# EAGLE design photon_at7020_1_rf_test (EAGLE 7.1.0)
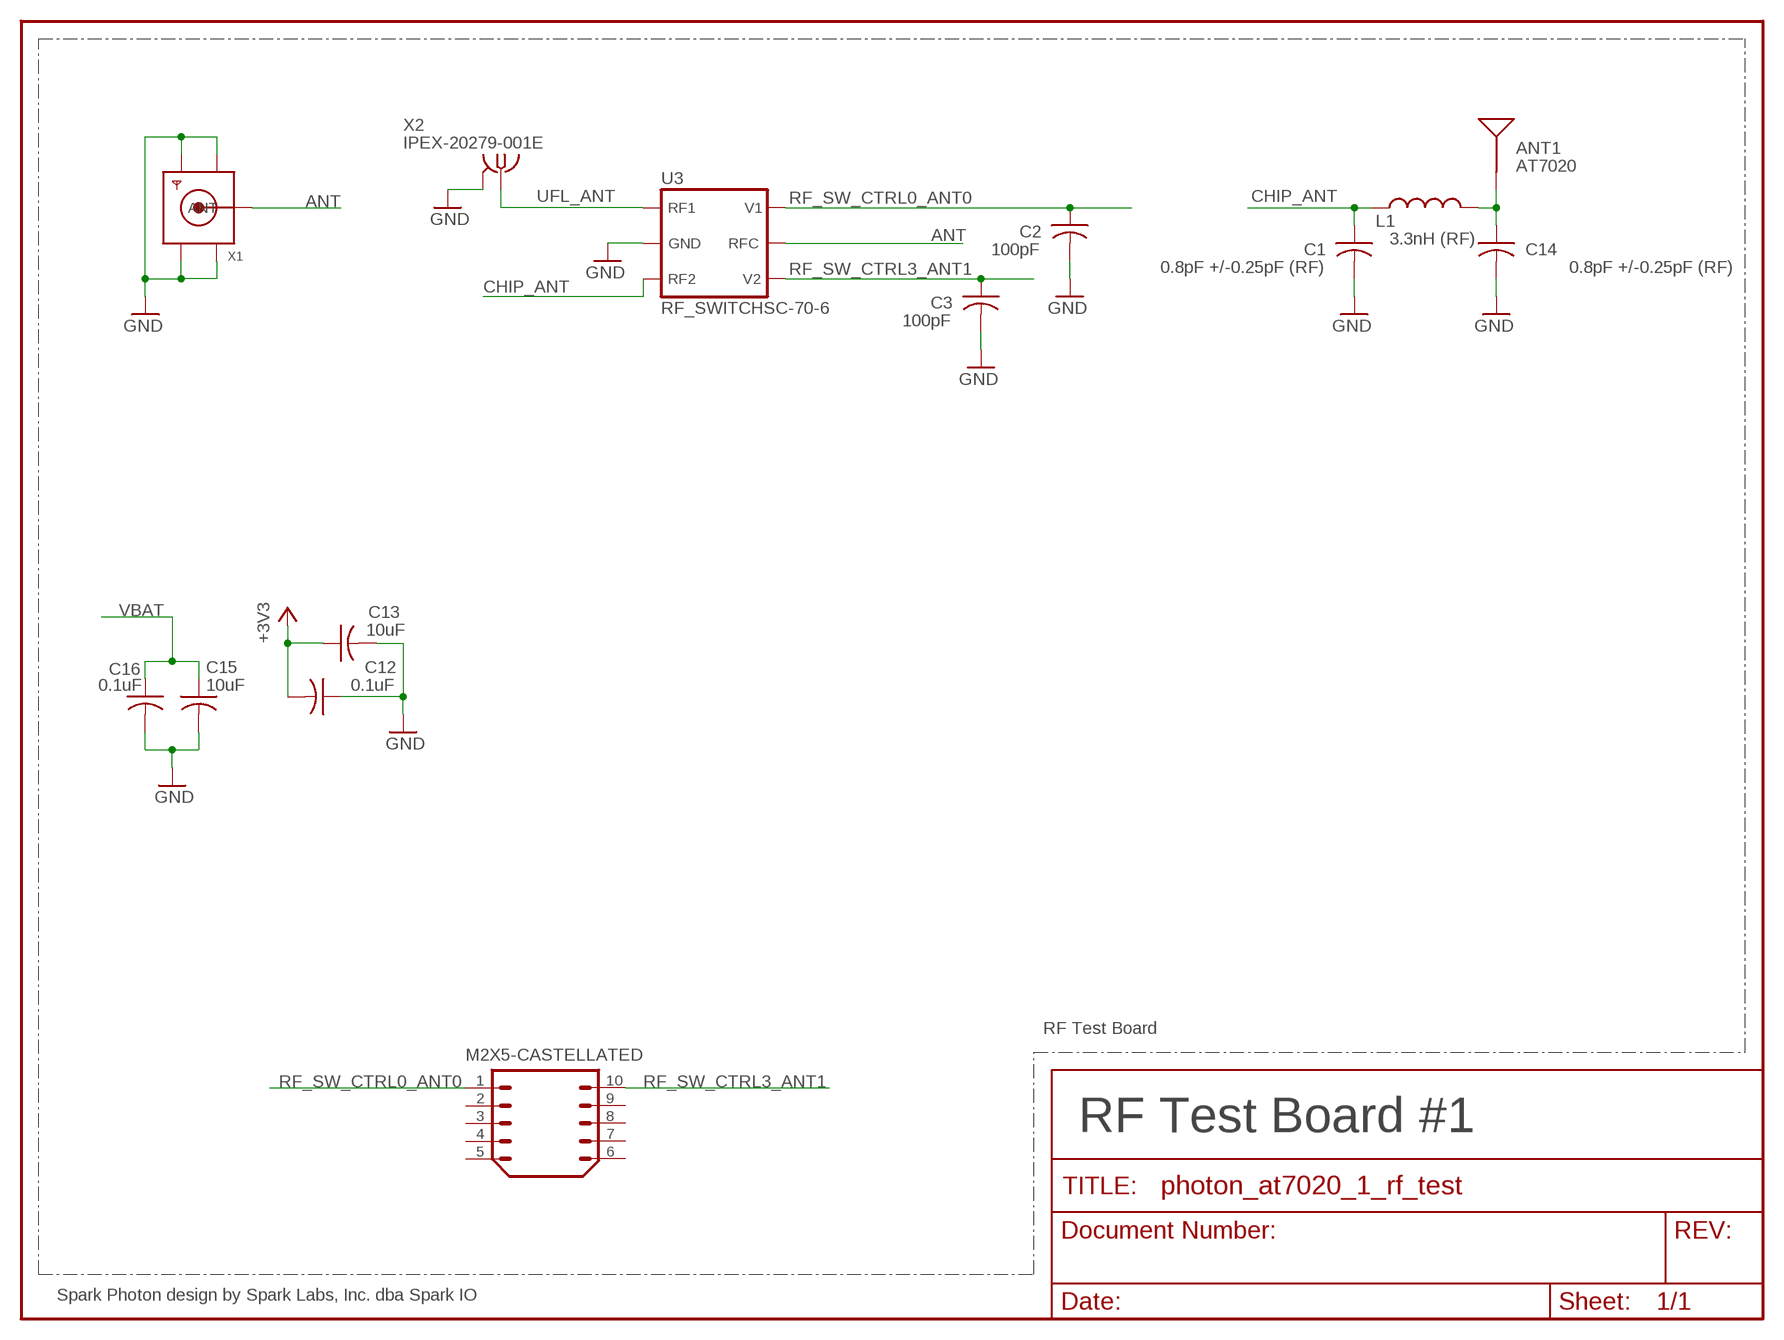
[diagram p0: schematic, sheet 1]

## Parts
ANT1  AT7020  [AT7020]
C1  0.8pF +/-0.25pF (RF)  C-US  [C0402_B]
C2  100pF  C-US  [C0402_B]
C3  100pF  C-US  [C0402_B]
C12  0.1uF  C-US  [C0402_B]
C13  10uF  C-US  [C0402_B]
C14  0.8pF +/-0.25pF (RF)  C-US  [C0402_B]
C15  10uF  C-US  [C0402_B]
C16  0.1uF  C-US  [C0402_B]
L1  3.3nH (RF)  INDUCTOR  [L0402_B]
M2X5-CASTELLATED  M2X5  [2X5-CASTELLATED]
U3  RF_SWITCHSC-70-6  [SC70-6]
X1  SMACONNECTOR_EDGE  [SMA_EDGELAUNCH]
X2  IPEX-20279-001E  [IPEX-20279-001E]

## Nets
+3V3: C12.2 C13.1
ANT [RF]: U3.5(RFC) X1.P(ANT)
CHIP_ANT [RF]: C1.1 L1.1 U3.3(RF2)
GND: C1.2 C2.2 C3.2 C12.1 C13.2 C14.2 C15.2 C16.2 U3.2(GND) X1.GND@1(GND4) X1.GND@2(GND3) X1.GND@3(GND2) X1.GND@4(GND1) X2.2@1(GND) X2.2@2(GND)
N$2 [RF]: ANT1.1(SIGNAL) C14.1 L1.2
RF_SW_CTRL0_ANT0: C2.1 M2X5-CASTELLATED.1 U3.6(V1)
RF_SW_CTRL3_ANT1: C3.1 M2X5-CASTELLATED.10 U3.4(V2)
UFL_ANT [RF]: U3.1(RF1) X2.1
VBAT: C15.1 C16.1
Unconnected: M2X5-CASTELLATED.2 M2X5-CASTELLATED.3 M2X5-CASTELLATED.4 M2X5-CASTELLATED.5 M2X5-CASTELLATED.6 M2X5-CASTELLATED.7 M2X5-CASTELLATED.8 M2X5-CASTELLATED.9

## Notes on the sheet
- RF Test Board
- RF Test Board #1
- Spark Photon design by Spark Labs, Inc. dba Spark IO

## Library data of the parts
ANT1 = Spark:AT7020
C1-C3 C12-C16 = Spark:C-US: Capacitor
L1 = Spark:INDUCTOR
M2X5-CASTELLATED = Spark:M2X5
U3 = Spark:RF_SWITCH: GaAs SPDT Switch DC - 3.0GHz+
X1 = adafruit:SMACONNECTOR: SMA Connector 90° DIP SMA Connector, 50 Ohm (4UConnector: 07259)
X2 = Spark:IPEX-20279-001E: Ultra Miniature Coaxial SMT RF Receptacle

## Net classes
2 RF: width 0.318 mm, clearance 0.191 mm

## Board
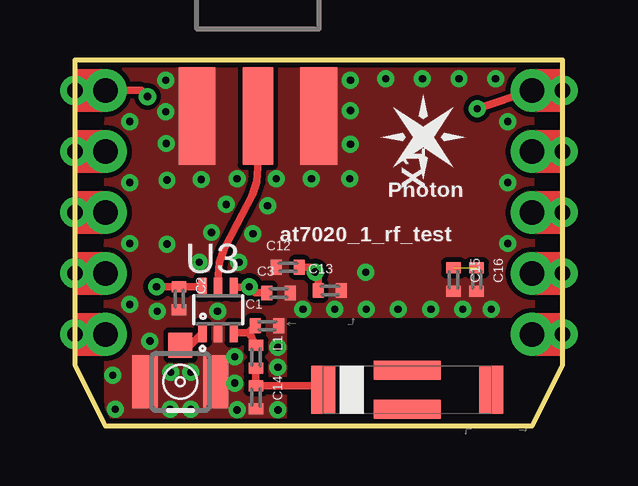
[diagram p1: board, top side]
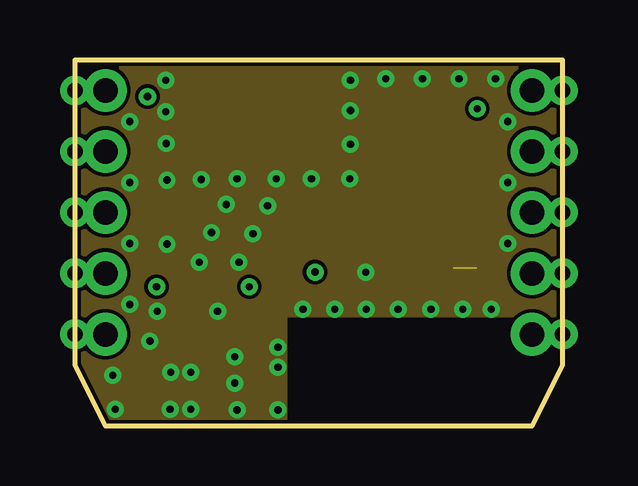
[diagram p2: board, inner layer $GND]
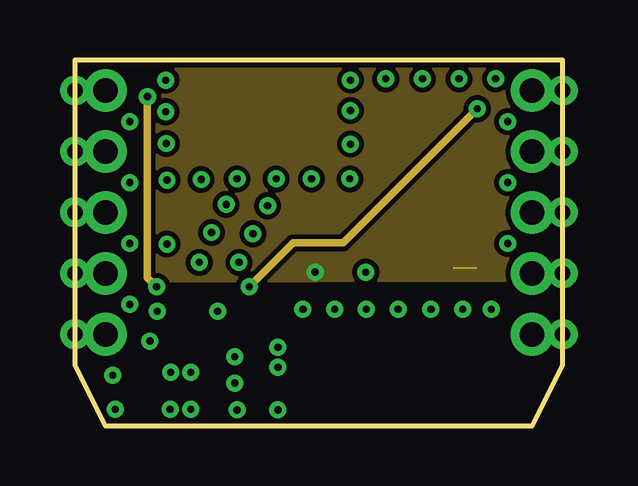
[diagram p3: board, inner layer $+3V3]
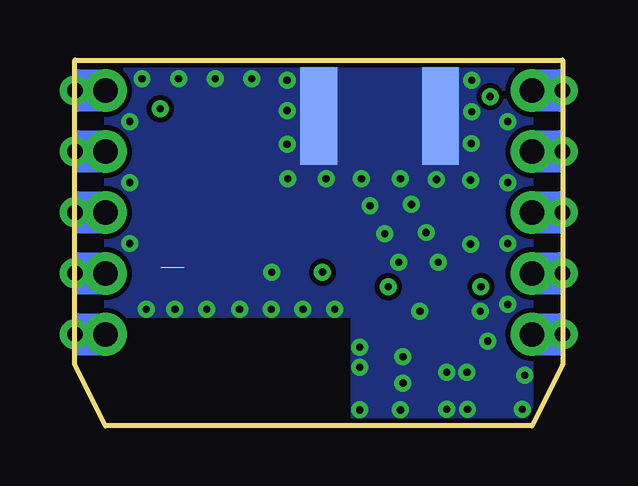
[diagram p4: board, bottom side, seen from below]

Size 20.32 x 15.24 mm. Coordinates in mm from the lower left corner, seen from the top.
Outline: 0,15.24 0,2.54 1.27,0 19.05,0 20.32,2.54 20.32,15.24 0,15.24
Copper layers (1+2*15+16): Top 0.018mm / dielectric 0.195mm / $GND 0.035mm / dielectric 1.1mm / $+3V3 0.035mm / dielectric 0.195mm / Bottom 0.018mm
Design rules "spark": minimum track width 6mil, minimum drill 0.3mm, track to track 6mil, track to pad 6mil, pad to pad 6mil, via to via 6mil, smd to smd 6mil, copper to edge 6mil, drill to drill 6mil, minimum pad ring 12mil, minimum via ring 8mil, stop-mask expansion 4mil, vias tented up to drill 20mil, thermal gap 8mil
tRestrict: area 7.8,28.2 to 10.5,29

### Footprints (pad centres in the part's own frame; a part is rotated, then mirrored left to right if it is on the bottom)
AT7020 = smd 1 x 2: 1 3.5,0; 3 -3.5,0 | smd 2.8 x 0.8: 2 0,0.815; 4 0,-0.815
C0402_B = smd 0.457 x 0.61: 1 -0.483,0; 2 0.483,0
L0402_B = smd 0.457 x 0.61: 1 -0.483,0; 2 0.483,0
2X5-CASTELLATED = drill 1.016 pad 1.778: 1 0,0; 2 0,-2.54; 3 0,-5.08; 4 0,-7.62; 5 0,-10.16; 6 17.78,-10.16; 7 17.78,-7.62; 8 17.78,-5.08; 9 17.78,-2.54; 10 17.78,0 | drill 0.635 pad 1.016: @1 -1.27,0; @2 -1.27,-2.54; @3 -1.27,-5.08; @4 -1.27,-7.62; @5 -1.27,-10.16; @6 19.05,-10.16; @7 19.05,-7.62; @8 19.05,-5.08; @9 19.05,-2.54; @10 19.05,0
SC70-6 = smd 0.35 x 0.8: 1 -0.65,-0.95; 2 0,-0.95; 3 0.65,-0.95; 4 0.65,0.95; 5 0,0.95; 6 -0.65,0.95
SMA_EDGELAUNCH = smd 4.064 x 1.524: GND@1 2.032,-2.54; GND@2 2.032,2.54 | smd 4.064 x 1.524 bottom: GND@3 2.032,2.54; GND@4 2.032,-2.54 | smd 4.064 x 1.27: P 2.032,0
IPEX-20279-001E = smd 1 x 1.05: 1 0,1.528 | smd 1.05 x 2.2: 2@1 -1.475,0; 2@2 1.475,0

### Placement (x,y rotation side)
ANT1  13.84,1.5 180 top
C1  8,4.17 0 top
C2  4.34,5.31 270 top
C3  8.48,5.54 0 top
C12  8.86,6.6 0 top
C13  10.62,5.64 0 top
C14  7.54,1.19 270 top
C15  15.77,6.1 270 top
C16  16.74,6.1 270 top
L1  7.54,2.87 270 top
M2X5-CASTELLATED  1.27,13.97 0 top
U3  5.97,4.83 0 top
X1  7.62,14.94 270 top
X2  4.39,1.83 0 top

### Tracks (layer width: path | path; a pad name or v marks a point on that pad's centre or on a via)
+3V3  (via drill 0.3)
  Top 0.305: C13.1 10.13,6.27 v10.01,6.4 9.8,6.6 C12.2
  pour $+3V3 (isolate 0.203, rank 2): 1.27,15.24 19.05,15.24 19.05,6.07 1.22,6.02
ANT
  Top 0.254: U3.5 5.96,5.84
  Top 0.318: X1.P 7.62,10.77 7.57,10.16 7.39,9.6 6.76,8.41 6.2,7.34 6.02,6.78 5.97,6.25 U3.5
CHIP_ANT
  Top 0.318: U3.3 7.23,3.88 | 7.23,3.88 C1.1 | 7.23,3.88 7.34,3.74 L1.1
GND  (via drill 0.3)
  Top 0.254: 8.94,5.66 8.94,5.56 C3.2
  other vias: 3.12,3.53 1.68,0.69 8.46,0.66 6.76,0.66 8.46,3.28 1.57,2.11 9.5,4.85 16.15,4.85 13.46,4.85 4.83,0.69 10.82,4.85 12.14,4.85 3.84,7.57 17.35,4.85 3.43,4.78 14.83,4.85 8.46,2.44 3.96,0.69 12.12,6.4 5.94,4.78 3.99,2.24 4.83,2.24 6.65,2.87 6.65,1.78 6.83,6.81 5.18,6.81 3.78,14.4 3.84,10.24 3.81,11.76 3.78,13.08 11.48,14.4 11.48,13.13 11.48,11.73 11.46,10.29 8.38,10.29 9.86,10.29 6.76,10.29 5.26,10.26 6.3,9.22 5.69,8.05 7.42,8 8.03,9.17 2.29,12.67 2.29,10.13 2.29,7.59 2.29,5.05 18.03,7.59 18.03,10.13 18.03,12.67 12.95,14.45 14.48,14.45 16,14.45 17.53,14.45
  pour Top (isolate 0.203, rank 3, no thermals): 1.3,15.24 19.08,15.24 19.1,4.57 8.76,4.57 8.76,0 1.3,0 1.27,3.81 1.27,5.08
  pour $GND: 0,35.56 20.32,35.56 20.32,4.6 8.74,4.6 8.74,0.08 1.32,0.08 0.13,2.54 0.13,3.05
  pour Bottom (isolate 0.203, rank 2, no thermals): 1.3,15.24 19.02,15.24 19.02,4.6 8.74,4.6 8.74,0 1.3,0
N$2
  Top 0.318: L1.2 C14.1 10.06,1.68
  Top 0.33: 10.06,1.68 10.24,1.5 ANT1.1
N$4
  cutout $GND: 7.52,32.19 arc-90 8.21,32.88 8.22,32.88 arc-91 8.9,32.19 arc-88 8.21,31.5 arc-92
N$17
  cutout $GND: 11.42,32.19 arc-90 12.11,32.88 12.12,32.88 arc-91 12.8,32.19 arc-88 12.11,31.5 arc-92
N$20
  cutout Bottom: 8.21,32.88 8.22,32.88 arc-91
RF_SW_CTRL0_ANT0  (via drill 0.3)
  Top 0.305: v3.02,13.72 2.77,13.97 M2X5-CASTELLATED.1
  Top 0.318: 5.3,5.79 C2.1 v3.4,5.79
  Top 0.33: U3.6 5.3,5.79
  $+3V3 0.305: v3.4,5.79 3.02,6.17 v3.02,13.72
RF_SW_CTRL3_ANT1  (via drill 0.3)
  Top 0.254: 7.26,5.78 v7.26,5.79
  Top 0.305: v16.76,13.21 M2X5-CASTELLATED.10
  Top 0.318: U3.4 7.26,5.78 | C3.1 7.52,5.54 v7.26,5.79
  $+3V3 0.305: v7.26,5.79 9.09,7.62 11.18,7.62 v16.76,13.21
UFL_ANT
  Top 0.318: 4.8,3.36 U3.1
  Top 0.33: X2.1 4.8,3.36
VBAT  (1 unrouted)

### Text on the board
tPlace: Photon | at7020_1_rf_test
tDocu: NOTES: / / Layer stack up: / 1 - GTL - Top Copper / 2 - G2L - Inner Ground / 15 - G15L - Inner +3.3V / 16 - GBL - Bottom Copper